# Altium schematic sheet TelecarRemoteControl.SchDoc
size 190 x 120 mm
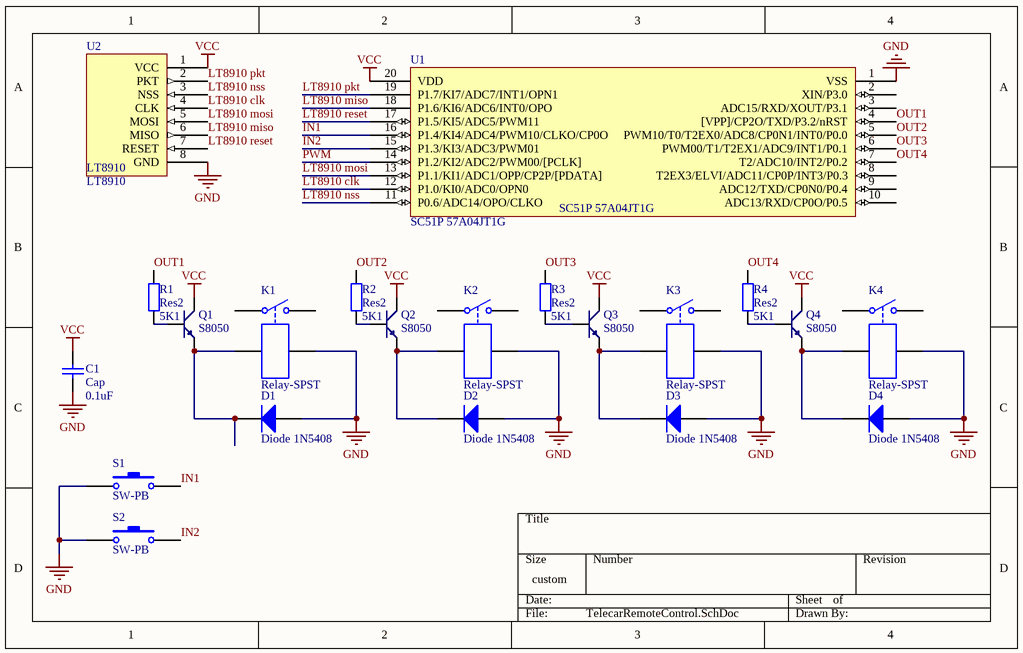
[diagram p0: TelecarRemoteControl.SchDoc]

## Parts
C1  Cap  value 0.1uF  [RAD-0.3]
D1  Diode 1N5408  [DIO18.84-9.6x5.6]
D2  Diode 1N5408  [DIO18.84-9.6x5.6]
D3  Diode 1N5408  [DIO18.84-9.6x5.6]
D4  Diode 1N5408  [DIO18.84-9.6x5.6]
K1  Relay-SPST  [DIP-P4]
K2  Relay-SPST  [DIP-P4]
K3  Relay-SPST  [DIP-P4]
K4  Relay-SPST  [DIP-P4]
Q1  S8050  [SOT-23R]
Q2  S8050  [SOT-23R]
Q3  S8050  [SOT-23R]
Q4  S8050  [SOT-23R]
R1  Res2  value 5K1  [AXIAL-0.4]
R2  Res2  value 5K1  [AXIAL-0.4]
R3  Res2  value 5K1  [AXIAL-0.4]
R4  Res2  value 5K1  [AXIAL-0.4]
S1  SW-PB  [SPST-2]
S2  SW-PB  [SPST-2]
U1  SC51P 57A04JT1G
U2  LT8910

## Nets
GND: C1.1 D1.1(A) D2.1(A) D3.1(A) D4.1(A) K1.4 K2.4 K3.4 K4.4 S1.1 S2.1 U1.1(VSS) U2.8(GND)
VCC: C1.2 Q1.3(C) Q2.3(C) Q3.3(C) Q4.3(C) U1.20(VDD) U2.1(VCC)
IN1: S1.2 U1.16(P1.4/KI4/ADC4/PWM10/CLKO/CP0O)
IN2: S2.2 U1.15(P1.3/KI3/ADC3/PWM01)
LT8910 clk: U1.12(P1.0/KI0/ADC0/OPN0) U2.4(CLK)
LT8910 miso: U1.18(P1.6/KI6/ADC6/INT0/OPO) U2.6(MISO)
LT8910 mosi: U1.13(P1.1/KI1/ADC1/OPP/CP2P/[PDATA]) U2.5(MOSI)
LT8910 nss: U1.11(P0.6/ADC14/OPO/CLKO) U2.3(NSS)
LT8910 pkt: U1.19(P1.7/KI7/ADC7/INT1/OPN1) U2.2(PKT)
LT8910 reset: U1.17(P1.5/KI5/ADC5/PWM11) U2.7(RESET)
OUT1: R1.2 U1.4([VPP]/CP2O/TXD/P3.2/nRST)
OUT2: R2.2 U1.5(PWM10/T0/T2EX0/ADC8/CP0N1/INT0/P0.0)
OUT3: R3.2 U1.6(PWM00/T1/T2EX1/ADC9/INT1/P0.1)
OUT4: R4.2 U1.7(T2/ADC10/INT2/P0.2)
PWM: U1.14(P1.2/KI2/ADC2/PWM00/[PCLK])
NetD1_2: D1.2(K) K1.3 Q1.1(E)
NetD2_2: D2.2(K) K2.3 Q2.1(E)
NetD3_2: D3.2(K) K3.3 Q3.1(E)
NetD4_2: D4.2(K) K4.3 Q4.1(E)
NetQ1_2: Q1.2(B) R1.1
NetQ2_2: Q2.2(B) R2.1
NetQ3_2: Q3.2(B) R3.1
NetQ4_2: Q4.2(B) R4.1

Not connected (* = marked no-connect by the designer): K1 1 2; K2 1 2; K3 1 2; K4 1 2; U1 2(XIN/P3.0) 3(ADC15/RXD/XOUT/P3.1) 8(T2EX3/ELVI/ADC11/CP0P/INT3/P0.3) 9(ADC12/TXD/CP0N0/P0.4) 10(ADC13/RXD/CP0O/P0.5)

## Library data of the parts
C1 = Cap: Capacitor; Published: 8-Jun-2000; LatestRevisionDate: 17-Jul-2002; LatestRevisionNote: Re-released for DXP Platform.; PackageReference: RAD-0.3; Publisher: Altium Limited
D1-D4 = Diode 1N5408: 3 Amp Medium Power Silicon Rectifier Diode; Published: 8-Jun-2000; LatestRevisionDate: 17-Jul-2002; LatestRevisionNote: Re-released for DXP Platform.; DatasheetVersion: Aug-1984; PackageReference: DO-201AD; Publisher: Altium Limited; ComponentLink1Description: Manufacturer Link; ComponentLink1URL: http://www.irf.com/
K1-K4 = Relay-SPST: Single-Pole Single-Throw Relay; Published: 24-Mar-1999; LatestRevisionDate: 17-Jul-2002; LatestRevisionNote: Re-released for DXP Platform.; PackageReference: MODULE4; Publisher: Altium Limited
Q1-Q4 = NPN: 8050/BCW846/BCW847
R1-R4 = Res2: Resistor; Published: 8-Jun-2000; LatestRevisionDate: 17-Jul-2002; LatestRevisionNote: Re-released for DXP Platform.; PackageReference: AXIAL-0.4; Publisher: Altium Limited
S1 S2 = SW-PB: Switch; Published: 24-Mar-1999; LatestRevisionDate: 17-Jul-2002; LatestRevisionNote: Re-released for DXP Platform.; PackageReference: SPST-2; Publisher: Altium Limited